# Altium schematic sheet LEDStrips.SchDoc
size A
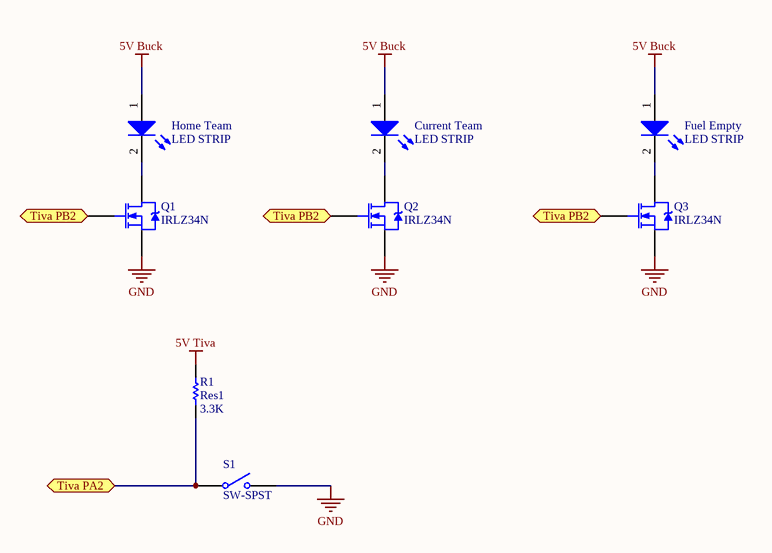
[diagram p0: LEDStrips.SchDoc]

## Parts
Current_Team  LED STRIP  [LED-0]
Fuel_Empty  LED STRIP  [LED-0]
Home_Team  LED STRIP  [LED-0]
Q1  IRLZ34N  [SFM-T3/A4.7V]
Q2  IRLZ34N  [SFM-T3/A4.7V]
Q3  IRLZ34N  [SFM-T3/A4.7V]
R1  Res1  value 3.3K  [AXIAL-0.3]
S1  SW-SPST  [SPST-2]

## Ports
Tiva PA2, Tiva PB2

## Nets
5V Buck: Current_Team.1(A) Fuel_Empty.1(A) Home_Team.1(A)
5V Tiva: R1.2
GND: Q1.3(S) Q2.3(S) Q3.3(S) S1.2(NO)
Tiva PA2: R1.1 S1.1(COMMON) ; port Tiva PA2
Tiva PB2: Q1.1(G) Q2.1(G) Q3.1(G) ; port Tiva PB2
NetCurrent_Team_2: Current_Team.2(K) Q2.2(D)
NetFuel_Empty_2: Fuel_Empty.2(K) Q3.2(D)
NetHome_Team_2: Home_Team.2(K) Q1.2(D)

## Library data of the parts
Current_Team Fuel_Empty Home_Team = LED0: Typical INFRARED GaAs LED; Manufacturer: Generic Components; Class: Optoelectronic; Published: 08/06/2000; Publisher: Altium Hobart Technology Centre; SubClass: LED
Q1-Q3 = NMOS-2: N-Channel Power MOSFET; Manufacturer: Generic Components; Class: Discrete; SubClass: MOSFET - Power; Note: Pin 2 is electrically connected to pin 4.; Published: 08/06/2000
R1 = Res1: Resistor; Manufacturer: Generic Components; Class: Passive; Published: 08/06/2000; Publisher: Altium Hobart Technology Centre; SubClass: Resistor
S1 = SW-SPST: Single-Pole, Single-Throw Switch; Manufacturer: Generic Components; Published: 1999